# Altium schematic sheet Connectors - Analog.SchDoc: Connectors - Analog
size B; DrawnBy: Jasper Yun; SheetNumber: 2; SheetTotal: 13; Competition: SAC 2021; Subteam: Avionics; University: McGill University; Location: Montreal, Quebec; Project: Avionics Project Name; MRT: McGill Rocket Team
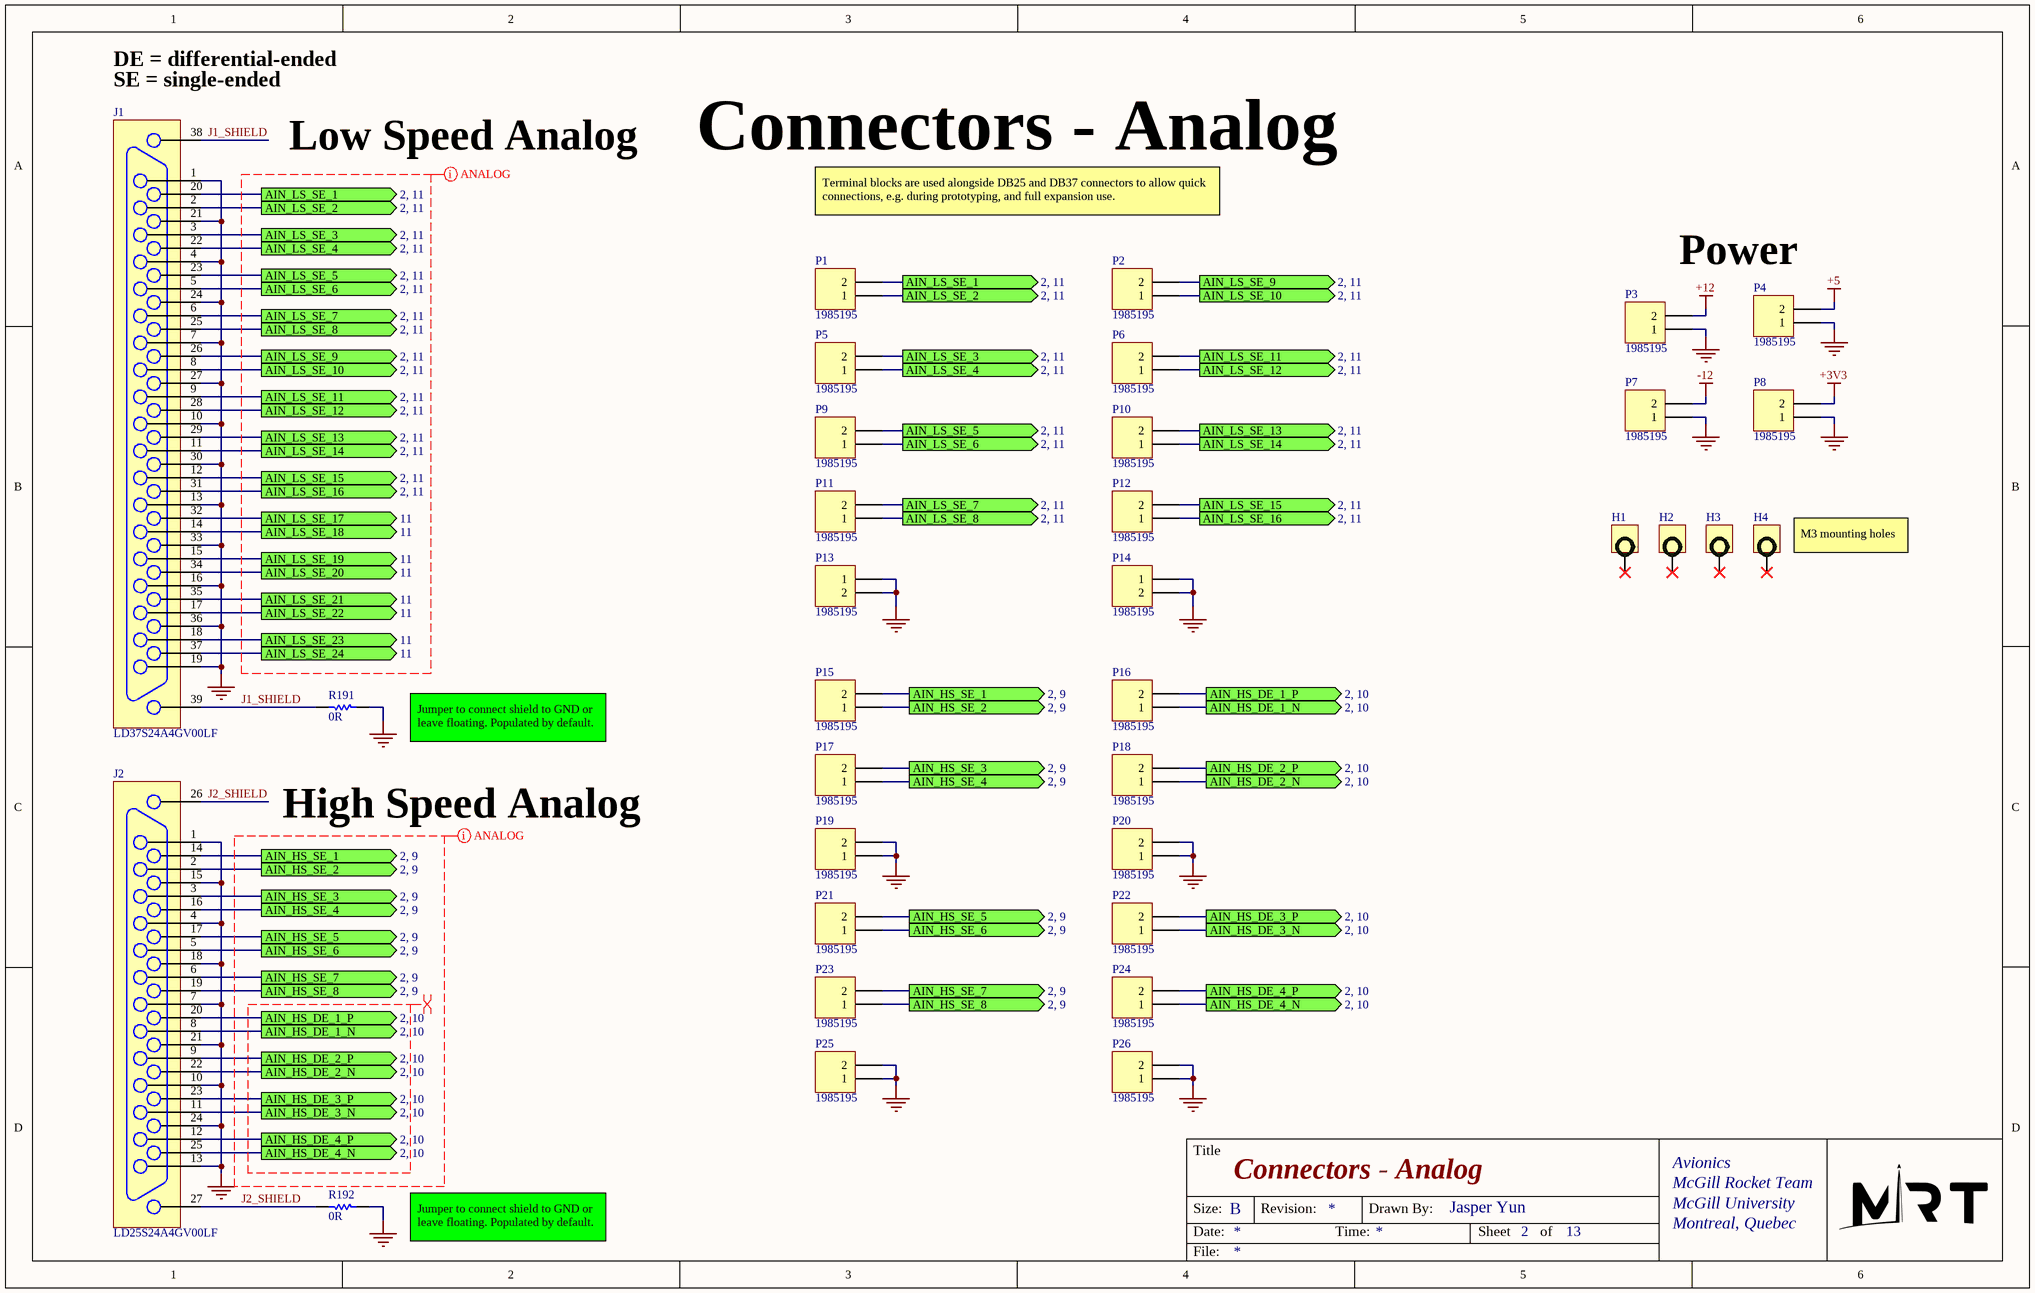
[diagram p0: Connectors - Analog.SchDoc]

## Parts
H1  M3  [HOLE M3]  (value not drawn)  (no BOM)
H2  M3  [HOLE M3]  (value not drawn)  (no BOM)
H3  M3  [HOLE M3]  (value not drawn)  (no BOM)
H4  M3  [HOLE M3]  (value not drawn)  (no BOM)
J1  LD37S24A4GV00LF  [Connector DB37 Vertical LD37S24A4GV00LF]
J2  LD25S24A4GV00LF  [Connector DB25 Vertical LD25S24A4GV00LF]
P1  1985195  [Terminal Block 1985195 2-pos 3.5mm pitch]
P2  1985195  [Terminal Block 1985195 2-pos 3.5mm pitch]
P3  1985195  [Terminal Block 1985195 2-pos 3.5mm pitch]
P4  1985195  [Terminal Block 1985195 2-pos 3.5mm pitch]
P5  1985195  [Terminal Block 1985195 2-pos 3.5mm pitch]
P6  1985195  [Terminal Block 1985195 2-pos 3.5mm pitch]
P7  1985195  [Terminal Block 1985195 2-pos 3.5mm pitch]
P8  1985195  [Terminal Block 1985195 2-pos 3.5mm pitch]
P9  1985195  [Terminal Block 1985195 2-pos 3.5mm pitch]
P10  1985195  [Terminal Block 1985195 2-pos 3.5mm pitch]
P11  1985195  [Terminal Block 1985195 2-pos 3.5mm pitch]
P12  1985195  [Terminal Block 1985195 2-pos 3.5mm pitch]
P13  1985195  [Terminal Block 1985195 2-pos 3.5mm pitch]
P14  1985195  [Terminal Block 1985195 2-pos 3.5mm pitch]
P15  1985195  [Terminal Block 1985195 2-pos 3.5mm pitch]
P16  1985195  [Terminal Block 1985195 2-pos 3.5mm pitch]
P17  1985195  [Terminal Block 1985195 2-pos 3.5mm pitch]
P18  1985195  [Terminal Block 1985195 2-pos 3.5mm pitch]
P19  1985195  [Terminal Block 1985195 2-pos 3.5mm pitch]
P20  1985195  [Terminal Block 1985195 2-pos 3.5mm pitch]
P21  1985195  [Terminal Block 1985195 2-pos 3.5mm pitch]
P22  1985195  [Terminal Block 1985195 2-pos 3.5mm pitch]
P23  1985195  [Terminal Block 1985195 2-pos 3.5mm pitch]
P24  1985195  [Terminal Block 1985195 2-pos 3.5mm pitch]
P25  1985195  [Terminal Block 1985195 2-pos 3.5mm pitch]
P26  1985195  [Terminal Block 1985195 2-pos 3.5mm pitch]
R191  0R  [0402 RES]
R192  0R  [0402 RES]

## Ports
AIN_HS_DE_1_N (out, see 2, 10), AIN_HS_DE_1_P (out, see 2, 10), AIN_HS_DE_2_N (out, see 2, 10), AIN_HS_DE_2_P (out, see 2, 10), AIN_HS_DE_3_N (out, see 2, 10), AIN_HS_DE_3_P (out, see 2, 10), AIN_HS_DE_4_N (out, see 2, 10), AIN_HS_DE_4_P (out, see 2, 10), AIN_HS_SE_1 (out, see 2, 9), AIN_HS_SE_2 (out, see 2, 9), AIN_HS_SE_3 (out, see 2, 9), AIN_HS_SE_4 (out, see 2, 9), AIN_HS_SE_5 (out, see 2, 9), AIN_HS_SE_6 (out, see 2, 9), AIN_HS_SE_7 (out, see 2, 9), AIN_HS_SE_8 (out, see 2, 9), AIN_LS_SE_1 (out, see 2, 11), AIN_LS_SE_2 (out, see 2, 11), AIN_LS_SE_3 (out, see 2, 11), AIN_LS_SE_4 (out, see 2, 11), AIN_LS_SE_5 (out, see 2, 11), AIN_LS_SE_6 (out, see 2, 11), AIN_LS_SE_7 (out, see 2, 11), AIN_LS_SE_8 (out, see 2, 11), AIN_LS_SE_9 (out, see 2, 11), AIN_LS_SE_10 (out, see 2, 11), AIN_LS_SE_11 (out, see 2, 11), AIN_LS_SE_12 (out, see 2, 11), AIN_LS_SE_13 (out, see 2, 11), AIN_LS_SE_14 (out, see 2, 11), AIN_LS_SE_15 (out, see 2, 11), AIN_LS_SE_16 (out, see 2, 11), AIN_LS_SE_17 (out, see 11), AIN_LS_SE_18 (out, see 11), AIN_LS_SE_19 (out, see 11), AIN_LS_SE_20 (out, see 11), AIN_LS_SE_21 (out, see 11), AIN_LS_SE_22 (out, see 11), AIN_LS_SE_23 (out, see 11), AIN_LS_SE_24 (out, see 11)

## Nets
+3V3: P8.2
+5: P4.2
+12: P3.2
-12: P7.2
GND: J1.1 J1.4 J1.7 J1.10 J1.13 J1.16 J1.19 J1.21 J1.24 J1.27 J1.30 J1.33 J1.36 J2.1 J2.4 J2.7 J2.10 J2.13 J2.15 J2.18 J2.21 J2.24 P3.1 P4.1 P7.1 P8.1 P13.1 P13.2 P14.1 P14.2 P19.1 P19.2 P20.1 P20.2 P25.1 P25.2 P26.1 P26.2 R191.2 R192.2
AIN_HS_DE_1_N: J2.8 P16.1 ; port AIN_HS_DE_1_N
AIN_HS_DE_1_P: J2.20 P16.2 ; port AIN_HS_DE_1_P
AIN_HS_DE_2_N: J2.22 P18.1 ; port AIN_HS_DE_2_N
AIN_HS_DE_2_P: J2.9 P18.2 ; port AIN_HS_DE_2_P
AIN_HS_DE_3_N: J2.11 P22.1 ; port AIN_HS_DE_3_N
AIN_HS_DE_3_P: J2.23 P22.2 ; port AIN_HS_DE_3_P
AIN_HS_DE_4_N: J2.25 P24.1 ; port AIN_HS_DE_4_N
AIN_HS_DE_4_P: J2.12 P24.2 ; port AIN_HS_DE_4_P
AIN_HS_SE_1: J2.14 P15.2 ; port AIN_HS_SE_1
AIN_HS_SE_2: J2.2 P15.1 ; port AIN_HS_SE_2
AIN_HS_SE_3: J2.3 P17.2 ; port AIN_HS_SE_3
AIN_HS_SE_4: J2.16 P17.1 ; port AIN_HS_SE_4
AIN_HS_SE_5: J2.17 P21.2 ; port AIN_HS_SE_5
AIN_HS_SE_6: J2.5 P21.1 ; port AIN_HS_SE_6
AIN_HS_SE_7: J2.6 P23.2 ; port AIN_HS_SE_7
AIN_HS_SE_8: J2.19 P23.1 ; port AIN_HS_SE_8
AIN_LS_SE_1: J1.20 P1.2 ; port AIN_LS_SE_1
AIN_LS_SE_2: J1.2 P1.1 ; port AIN_LS_SE_2
AIN_LS_SE_3: J1.3 P5.2 ; port AIN_LS_SE_3
AIN_LS_SE_4: J1.22 P5.1 ; port AIN_LS_SE_4
AIN_LS_SE_5: J1.23 P9.2 ; port AIN_LS_SE_5
AIN_LS_SE_6: J1.5 P9.1 ; port AIN_LS_SE_6
AIN_LS_SE_7: J1.6 P11.2 ; port AIN_LS_SE_7
AIN_LS_SE_8: J1.25 P11.1 ; port AIN_LS_SE_8
AIN_LS_SE_9: J1.26 P2.2 ; port AIN_LS_SE_9
AIN_LS_SE_10: J1.8 P2.1 ; port AIN_LS_SE_10
AIN_LS_SE_11: J1.9 P6.2 ; port AIN_LS_SE_11
AIN_LS_SE_12: J1.28 P6.1 ; port AIN_LS_SE_12
AIN_LS_SE_13: J1.29 P10.2 ; port AIN_LS_SE_13
AIN_LS_SE_14: J1.11 P10.1 ; port AIN_LS_SE_14
AIN_LS_SE_15: J1.12 P12.2 ; port AIN_LS_SE_15
AIN_LS_SE_16: J1.31 P12.1 ; port AIN_LS_SE_16
AIN_LS_SE_17: J1.32 ; port AIN_LS_SE_17
AIN_LS_SE_18: J1.14 ; port AIN_LS_SE_18
AIN_LS_SE_19: J1.15 ; port AIN_LS_SE_19
AIN_LS_SE_20: J1.34 ; port AIN_LS_SE_20
AIN_LS_SE_21: J1.35 ; port AIN_LS_SE_21
AIN_LS_SE_22: J1.17 ; port AIN_LS_SE_22
AIN_LS_SE_23: J1.18 ; port AIN_LS_SE_23
AIN_LS_SE_24: J1.37 ; port AIN_LS_SE_24
J1_SHIELD: J1.38 J1.39 R191.1
J2_SHIELD: J2.26 J2.27 R192.1

Not connected (* = marked no-connect by the designer): H1 1(TERMINAL)*; H2 1(TERMINAL)*; H3 1(TERMINAL)*; H4 1(TERMINAL)*

## Layout directives
differential pair; differential pair class AIN_HS_DE: (no net found under the mark)
net class ANALOG: (no net found under the mark)

## Notes on the sheet
- DE = differential-ended
- (near J1) SE = single-ended
- Low Speed Analog
- Terminal blocks are used alongside DB25 and DB37 connectors to allow quick connections, e.g. during prototyping, and full expansion use.
- Power
- (near H4) M3 mounting holes
- Jumper to connect shield to GND or leave floating. Populated by default.
- High Speed Analog
- Title
- Size:
- Date:
- B
- Revision:
- Time:
- Drawn By:
- Sheet
- of
- File:

## Library data of the parts
H1-H4 = Hole
J1 = Connector DB37 (LD37S24A4GV00LF): DB37 LD37S24A4GV00LF (Amphenol ICC)
J2 = Connector DB25 (LD25S24A4GV00LF): DB25 LD25S24A4GV00LF (Amphenol ICC)
P1-P26 = Header 2: Header, 2-Pin; LatestRevisionDate: 17-Jul-2002; LatestRevisionNote: Re-released for DXP Platform.; Publisher: Altium Limited
R191 R192 = Res1: Resistor; Value: 1%; Published: 8-Jun-2000; LatestRevisionDate: 17-Jul-2002; LatestRevisionNote: Re-released for DXP Platform.; PackageReference: AXIAL-0.3; Publisher: Altium Limited; PackageDescription: Axial Device, Thru-Hole; 2 Leads; 0.3 in Pin Spacing